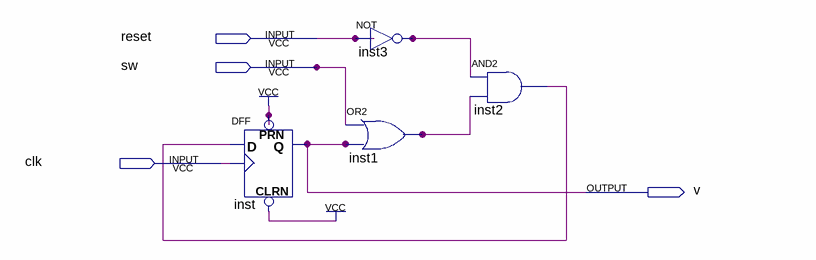
[diagram p0: schematic sheet]
// Quartus schematic sword.bdf as structural Verilog: 4 symbols, 4 pins
module sword (
  input  reset,
  input  sw,
  input  clk,
  output v
);

  wire inst1_out, inst2_out, inst3_out;

  DFF inst (.CLRN(1'b1), .CLK(clk), .D(inst2_out), .PRN(1'b1), .Q(v));
  or inst1 (inst1_out, sw, v);
  not inst3 (inst3_out, reset);
  and inst2 (inst2_out, inst3_out, inst1_out);
endmodule
